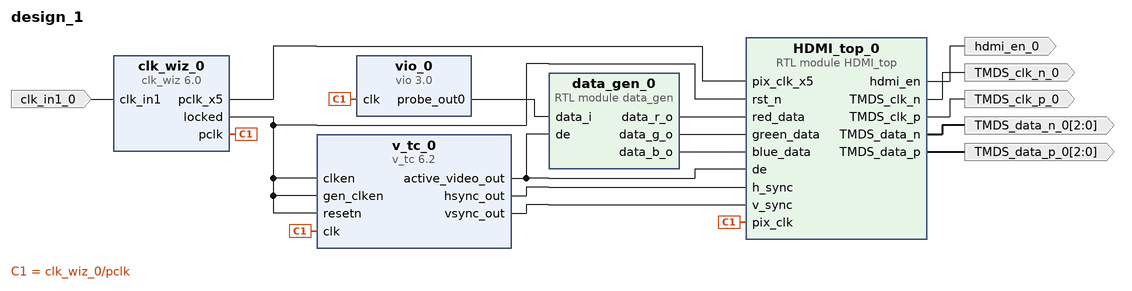
[diagram p0: block diagram of the top level]
# Vivado block design design_1, xc7z010clg400-1, Vivado 2020.2
create_bd_design design_1

create_bd_port -dir O -type clk TMDS_clk_n_0
create_bd_port -dir O -from 2 -to 0 TMDS_data_p_0
create_bd_port -dir O -type clk TMDS_clk_p_0
create_bd_port -dir O -from 2 -to 0 TMDS_data_n_0
create_bd_port -dir I -type clk clk_in1_0
set_property -dict {CONFIG.FREQ_HZ 50000000} [get_bd_ports clk_in1_0]
create_bd_port -dir O hdmi_en_0

create_bd_cell -type module -reference HDMI_top HDMI_top_0
create_bd_cell -type module -reference data_gen data_gen_0
create_bd_cell -type ip -vlnv xilinx.com:ip:vio:3.0 vio_0
set_property -dict {CONFIG.C_NUM_PROBE_IN 0 CONFIG.C_NUM_PROBE_OUT 1 CONFIG.C_PROBE_OUT0_WIDTH 24} [get_bd_cells vio_0]
create_bd_cell -type ip -vlnv xilinx.com:ip:clk_wiz:6.0 clk_wiz_0
set_property -dict [list \
  CONFIG.CLKIN1_JITTER_PS 200.0 \
  CONFIG.CLKOUT1_JITTER 155.608 \
  CONFIG.CLKOUT1_PHASE_ERROR 158.235 \
  CONFIG.CLKOUT1_REQUESTED_OUT_FREQ 75 \
  CONFIG.CLKOUT2_JITTER 117.790 \
  CONFIG.CLKOUT2_PHASE_ERROR 158.235 \
  CONFIG.CLKOUT2_REQUESTED_OUT_FREQ 375 \
  CONFIG.CLKOUT2_USED true \
  CONFIG.CLK_OUT1_PORT pclk \
  CONFIG.CLK_OUT2_PORT pclk_x5 \
  CONFIG.MMCM_CLKFBOUT_MULT_F 22.500 \
  CONFIG.MMCM_CLKIN1_PERIOD 20.000 \
  CONFIG.MMCM_CLKIN2_PERIOD 10.0 \
  CONFIG.MMCM_CLKOUT0_DIVIDE_F 15.000 \
  CONFIG.MMCM_CLKOUT1_DIVIDE 3 \
  CONFIG.NUM_OUT_CLKS 2 \
  CONFIG.PRIM_IN_FREQ 50 \
  CONFIG.USE_RESET false \
] [get_bd_cells clk_wiz_0]
create_bd_cell -type ip -vlnv xilinx.com:ip:v_tc:6.2 v_tc_0
set_property -dict {CONFIG.HAS_AXI4_LITE false CONFIG.enable_detection false} [get_bd_cells v_tc_0]

# ---- connections ----

connect_bd_net [get_bd_pins clk_wiz_0/pclk_x5] [get_bd_pins HDMI_top_0/pix_clk_x5]
connect_bd_net [get_bd_pins clk_wiz_0/locked] \
  [get_bd_pins HDMI_top_0/rst_n] [get_bd_pins v_tc_0/clken] [get_bd_pins v_tc_0/gen_clken] [get_bd_pins v_tc_0/resetn]
connect_bd_net [get_bd_pins v_tc_0/active_video_out] [get_bd_pins HDMI_top_0/de] [get_bd_pins data_gen_0/de]
connect_bd_net [get_bd_pins v_tc_0/hsync_out] [get_bd_pins HDMI_top_0/h_sync]
connect_bd_net [get_bd_pins v_tc_0/vsync_out] [get_bd_pins HDMI_top_0/v_sync]
connect_bd_net [get_bd_pins HDMI_top_0/TMDS_clk_n] [get_bd_ports TMDS_clk_n_0]
connect_bd_net [get_bd_pins HDMI_top_0/TMDS_data_p] [get_bd_ports TMDS_data_p_0]
connect_bd_net [get_bd_pins HDMI_top_0/TMDS_clk_p] [get_bd_ports TMDS_clk_p_0]
connect_bd_net [get_bd_pins HDMI_top_0/TMDS_data_n] [get_bd_ports TMDS_data_n_0]
connect_bd_net -net clk_in1_0_1 [get_bd_ports clk_in1_0] [get_bd_pins clk_wiz_0/clk_in1]
connect_bd_net [get_bd_pins data_gen_0/data_r_o] [get_bd_pins HDMI_top_0/red_data]
connect_bd_net [get_bd_pins data_gen_0/data_g_o] [get_bd_pins HDMI_top_0/green_data]
connect_bd_net [get_bd_pins data_gen_0/data_b_o] [get_bd_pins HDMI_top_0/blue_data]
connect_bd_net [get_bd_pins vio_0/probe_out0] [get_bd_pins data_gen_0/data_i]
connect_bd_net [get_bd_pins HDMI_top_0/hdmi_en] [get_bd_ports hdmi_en_0]
connect_bd_net [get_bd_pins clk_wiz_0/pclk] [get_bd_pins HDMI_top_0/pix_clk] [get_bd_pins vio_0/clk] [get_bd_pins v_tc_0/clk]

validate_bd_design
save_bd_design
